# EAGLE design TeensyBalanceBoard (EAGLE 7.7.0)
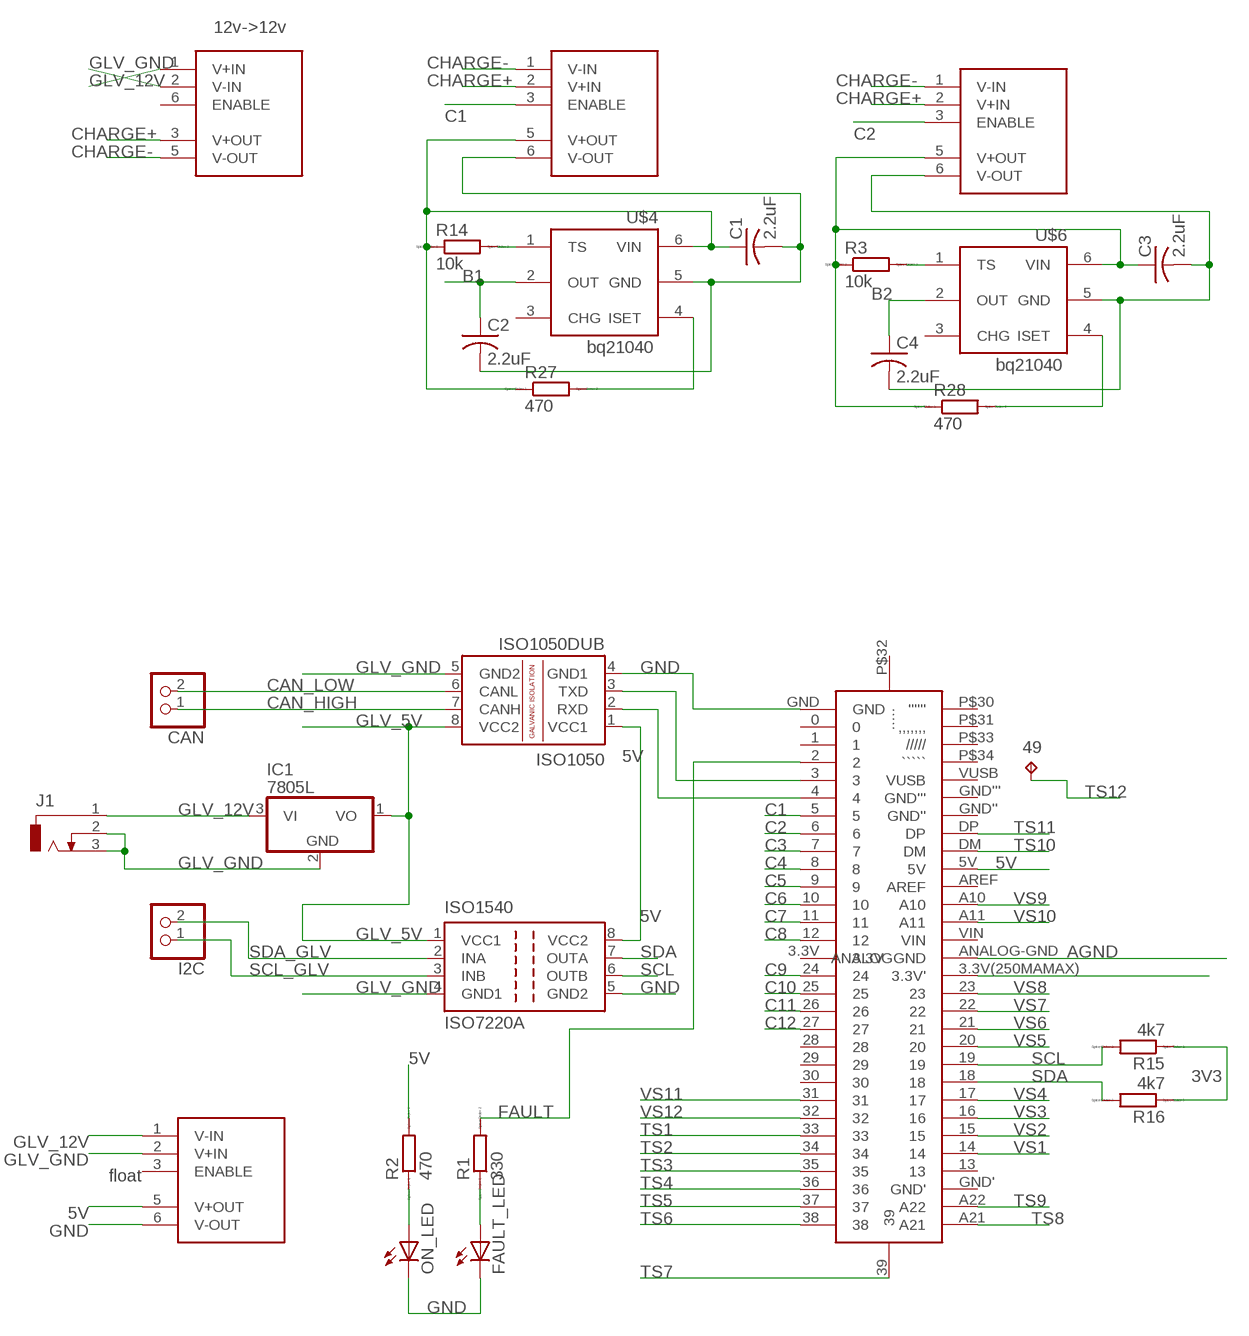
[diagram p0: schematic, sheet 1, part 1 of 2]
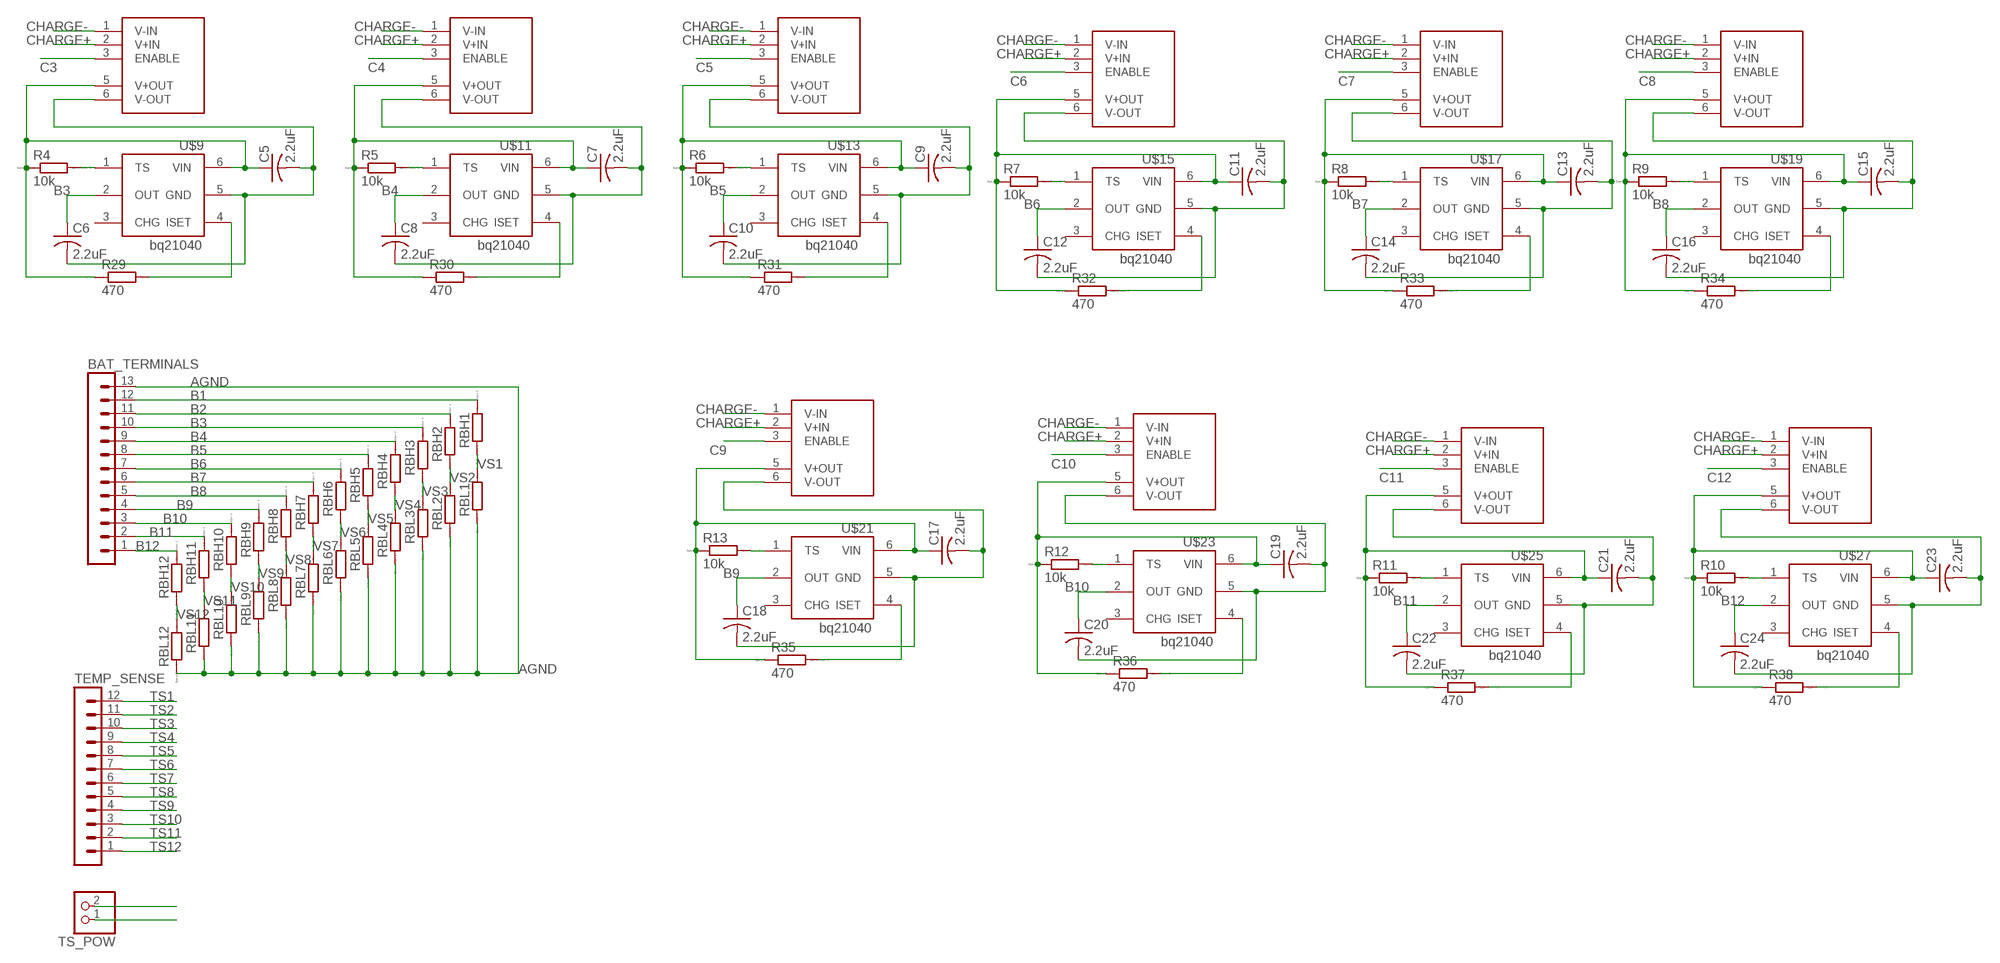
[diagram p1: schematic, sheet 1, part 2 of 2]

## Parts
49  TPTP20SQ  [TP20SQ]
BAT_TERMINALS  MA13-1  [MA13-1]
C1  2.2uF  C-USC0603  [C0603]
C2  2.2uF  C-USC0603  [C0603]
C3  2.2uF  C-USC0603  [C0603]
C4  2.2uF  C-USC0603  [C0603]
C5  2.2uF  C-USC0603  [C0603]
C6  2.2uF  C-USC0603  [C0603]
C7  2.2uF  C-USC0603  [C0603]
C8  2.2uF  C-USC0603  [C0603]
C9  2.2uF  C-USC0603  [C0603]
C10  2.2uF  C-USC0603  [C0603]
C11  2.2uF  C-USC0603  [C0603]
C12  2.2uF  C-USC0603  [C0603]
C13  2.2uF  C-USC0603  [C0603]
C14  2.2uF  C-USC0603  [C0603]
C15  2.2uF  C-USC0603  [C0603]
C16  2.2uF  C-USC0603  [C0603]
C17  2.2uF  C-USC0603  [C0603]
C18  2.2uF  C-USC0603  [C0603]
C19  2.2uF  C-USC0603  [C0603]
C20  2.2uF  C-USC0603  [C0603]
C21  2.2uF  C-USC0603  [C0603]
C22  2.2uF  C-USC0603  [C0603]
C23  2.2uF  C-USC0603  [C0603]
C24  2.2uF  C-USC0603  [C0603]
CAN  PINHD-1X2  [1X02]
FAULT_LED  LEDSMT1206  [1206]
I2C  PINHD-1X2  [1X02]
IC1  7805L  [TO92]
ISO1050  ISO1050DUB  [DUB-R-PDSO-G8]
ISO1540  ISO7220A  [SO-08]
J1  DCJ0303  [DCJ0303]
ON_LED  LEDSMT1206  [1206]
R1  330  RR0603  [R0603]
R2  470  RR0603  [R0603]
R3  10k  RR0603  [R0603]
R4  10k  RR0603  [R0603]
R5  10k  RR0603  [R0603]
R6  10k  RR0603  [R0603]
R7  10k  RR0603  [R0603]
R8  10k  RR0603  [R0603]
R9  10k  RR0603  [R0603]
R10  10k  RR0603  [R0603]
R11  10k  RR0603  [R0603]
R12  10k  RR0603  [R0603]
R13  10k  RR0603  [R0603]
R14  10k  RR0603  [R0603]
R15  4k7  RR0603  [R0603]
R16  4k7  RR0603  [R0603]
R27  470  RR0603  [R0603]
R28  470  RR0603  [R0603]
R29  470  RR0603  [R0603]
R30  470  RR0603  [R0603]
R31  470  RR0603  [R0603]
R32  470  RR0603  [R0603]
R33  470  RR0603  [R0603]
R34  470  RR0603  [R0603]
R35  470  RR0603  [R0603]
R36  470  RR0603  [R0603]
R37  470  RR0603  [R0603]
R38  470  RR0603  [R0603]
RBH1  RR0603  [R0603]
RBH2  RR0603  [R0603]
RBH3  RR0603  [R0603]
RBH4  RR0603  [R0603]
RBH5  RR0603  [R0603]
RBH6  RR0603  [R0603]
RBH7  RR0603  [R0603]
RBH8  RR0603  [R0603]
RBH9  RR0603  [R0603]
RBH10  RR0603  [R0603]
RBH11  RR0603  [R0603]
RBH12  RR0603  [R0603]
RBL1  RR0603  [R0603]
RBL2  RR0603  [R0603]
RBL3  RR0603  [R0603]
RBL4  RR0603  [R0603]
RBL5  RR0603  [R0603]
RBL6  RR0603  [R0603]
RBL7  RR0603  [R0603]
RBL8  RR0603  [R0603]
RBL9  RR0603  [R0603]
RBL10  RR0603  [R0603]
RBL11  RR0603  [R0603]
RBL12  RR0603  [R0603]
TEMP_SENSE  MA12-1  [MA12-1]
TS_POW  PINHD-1X2  [1X02]
U$1  TEENSY3.6  [TEENSY3.6]
U$2  EC4SAW-24S05N6-2411WI  [EC4SAW-24S05N]
U$3  EC4SAW-24S05N6-2411WI  [EC4SAW-24S05N]
U$4  10F200T  [SOT23-6]
U$5  EC4SAW-24S05N6-2411WI  [EC4SAW-24S05N]
U$6  10F200T  [SOT23-6]
U$7  EC4SAW-24S05N6-2411WI  [EC4SAW-24S05N]
U$8  PDQ30-Q24-S12-D  [PDQ30-Q24-S12-D]
U$9  10F200T  [SOT23-6]
U$10  EC4SAW-24S05N6-2411WI  [EC4SAW-24S05N]
U$11  10F200T  [SOT23-6]
U$12  EC4SAW-24S05N6-2411WI  [EC4SAW-24S05N]
U$13  10F200T  [SOT23-6]
U$14  EC4SAW-24S05N6-2411WI  [EC4SAW-24S05N]
U$15  10F200T  [SOT23-6]
U$16  EC4SAW-24S05N6-2411WI  [EC4SAW-24S05N]
U$17  10F200T  [SOT23-6]
U$18  EC4SAW-24S05N6-2411WI  [EC4SAW-24S05N]
U$19  10F200T  [SOT23-6]
U$20  EC4SAW-24S05N6-2411WI  [EC4SAW-24S05N]
U$21  10F200T  [SOT23-6]
U$22  EC4SAW-24S05N6-2411WI  [EC4SAW-24S05N]
U$23  10F200T  [SOT23-6]
U$24  EC4SAW-24S05N6-2411WI  [EC4SAW-24S05N]
U$25  10F200T  [SOT23-6]
U$26  EC4SAW-24S05N6-2411WI  [EC4SAW-24S05N]
U$27  10F200T  [SOT23-6]

## Nets
3V3: R15.1 R16.1 TS_POW.2 U$1.3.3V(250MAMAX)(3.3V')
5V [5vPower]: ISO1050.1(VCC1) ISO1540.8(VCC2) R2.2 U$1.5V U$3.5(V+OUT)
AGND [5vPower]: BAT_TERMINALS.13 C1.2 C2.2 RBL1.1 RBL2.1 RBL3.1 RBL4.1 RBL5.1 RBL6.1 RBL7.1 RBL8.1 RBL9.1 RBL10.1 RBL11.1 RBL12.1 TS_POW.1 U$1.ANALOG-GND(ANALOGGND) U$2.6(V-OUT) U$4.5(GND)
B1 [5vPower]: BAT_TERMINALS.12 C2.1 C3.2 C4.2 RBH1.2 U$4.2(OUT) U$5.6(V-OUT) U$6.5(GND)
B2 [5vPower]: BAT_TERMINALS.11 C4.1 C5.2 C6.2 RBH2.2 U$6.2(OUT) U$7.6(V-OUT) U$9.5(GND)
B3 [5vPower]: BAT_TERMINALS.10 C6.1 C7.2 C8.2 RBH3.2 U$9.2(OUT) U$10.6(V-OUT) U$11.5(GND)
B4 [5vPower]: BAT_TERMINALS.9 C8.1 C9.2 C10.2 RBH4.2 U$11.2(OUT) U$12.6(V-OUT) U$13.5(GND)
B5 [5vPower]: BAT_TERMINALS.8 C10.1 C11.2 C12.2 RBH5.2 U$13.2(OUT) U$14.6(V-OUT) U$15.5(GND)
B6 [5vPower]: BAT_TERMINALS.7 C12.1 C13.2 C14.2 RBH6.2 U$15.2(OUT) U$16.6(V-OUT) U$17.5(GND)
B7 [5vPower]: BAT_TERMINALS.6 C14.1 C15.2 C16.2 RBH7.2 U$17.2(OUT) U$18.6(V-OUT) U$19.5(GND)
B8 [5vPower]: BAT_TERMINALS.5 C16.1 C17.2 C18.2 RBH8.2 U$19.2(OUT) U$20.6(V-OUT) U$21.5(GND)
B9 [5vPower]: BAT_TERMINALS.4 C18.1 C19.2 C20.2 RBH9.2 U$21.2(OUT) U$22.6(V-OUT) U$23.5(GND)
B10 [5vPower]: BAT_TERMINALS.3 C20.1 C21.2 C22.2 RBH10.2 U$23.2(OUT) U$24.6(V-OUT) U$25.5(GND)
B11 [5vPower]: BAT_TERMINALS.2 C22.1 C23.2 C24.2 RBH11.2 U$25.2(OUT) U$26.6(V-OUT) U$27.5(GND)
B12 [5vPower]: BAT_TERMINALS.1 C24.1 RBH12.2 U$27.2(OUT)
C1: U$1.5 U$2.3(ENABLE)
C2: U$1.6 U$5.3(ENABLE)
C3: U$1.7 U$7.3(ENABLE)
C4: U$1.8 U$10.3(ENABLE)
C5: U$1.9 U$12.3(ENABLE)
C6: U$1.10 U$14.3(ENABLE)
C7: U$1.11 U$16.3(ENABLE)
C8: U$1.12 U$18.3(ENABLE)
C9: U$1.24 U$20.3(ENABLE)
C10: U$1.25 U$22.3(ENABLE)
C11: U$1.26 U$24.3(ENABLE)
C12: U$1.27 U$26.3(ENABLE)
CAN_HIGH: CAN.1 ISO1050.7(CANH)
CAN_LOW: CAN.2 ISO1050.6(CANL)
CHARGE+ [12vPower]: U$2.2(V+IN) U$5.2(V+IN) U$7.2(V+IN) U$8.3(V+OUT) U$10.2(V+IN) U$12.2(V+IN) U$14.2(V+IN) U$16.2(V+IN) U$18.2(V+IN) U$20.2(V+IN) U$22.2(V+IN) U$24.2(V+IN) U$26.2(V+IN)
CHARGE- [12vPower]: U$2.1(V-IN) U$5.1(V-IN) U$7.1(V-IN) U$8.5(V-OUT) U$10.1(V-IN) U$12.1(V-IN) U$14.1(V-IN) U$16.1(V-IN) U$18.1(V-IN) U$20.1(V-IN) U$22.1(V-IN) U$24.1(V-IN) U$26.1(V-IN)
FAULT: R1.2 U$1.2
GLV_5V: IC1.1(VO) ISO1050.8(VCC2) ISO1540.1(VCC1)
GLV_12V [12vPower]: IC1.3(VI) J1.1 U$3.1(V-IN) U$8.1(V+IN)
GLV_GND [12vPower]: IC1.2(GND) ISO1050.5(GND2) ISO1540.4(GND1) J1.2 J1.3 U$3.2(V+IN) U$8.2(V-IN)
GND [12vPower]: FAULT_LED.C ISO1050.4(GND1) ISO1540.5(GND2) ON_LED.C U$1.GND U$3.6(V-OUT)
N$1 [5vPower]: C1.1 R14.1 R27.1 U$2.5(V+OUT) U$4.6(VIN)
N$3: ISO1050.3(TXD) U$1.3
N$4: ISO1050.2(RXD) U$1.4
N$5 [5vPower]: C3.1 R3.1 R28.1 U$5.5(V+OUT) U$6.6(VIN)
N$6: ON_LED.A R2.1
N$7: FAULT_LED.A R1.1
N$8: R27.2 U$4.4(ISET)
N$9: R28.2 U$6.4(ISET)
N$10 [5vPower]: C5.1 R4.1 R29.1 U$7.5(V+OUT) U$9.6(VIN)
N$11: R29.2 U$9.4(ISET)
N$12 [5vPower]: C7.1 R5.1 R30.1 U$10.5(V+OUT) U$11.6(VIN)
N$13: R30.2 U$11.4(ISET)
N$14 [5vPower]: C9.1 R6.1 R31.1 U$12.5(V+OUT) U$13.6(VIN)
N$15: R31.2 U$13.4(ISET)
N$16 [5vPower]: C11.1 R7.1 R32.1 U$14.5(V+OUT) U$15.6(VIN)
N$17: R32.2 U$15.4(ISET)
N$18 [5vPower]: C13.1 R8.1 R33.1 U$16.5(V+OUT) U$17.6(VIN)
N$19: R33.2 U$17.4(ISET)
N$20 [5vPower]: C15.1 R9.1 R34.1 U$18.5(V+OUT) U$19.6(VIN)
N$21: R34.2 U$19.4(ISET)
N$22 [5vPower]: C17.1 R13.1 R35.1 U$20.5(V+OUT) U$21.6(VIN)
N$23: R35.2 U$21.4(ISET)
N$24 [5vPower]: C19.1 R12.1 R36.1 U$22.5(V+OUT) U$23.6(VIN)
N$25: R36.2 U$23.4(ISET)
N$26 [5vPower]: C21.1 R11.1 R37.1 U$24.5(V+OUT) U$25.6(VIN)
N$27: R37.2 U$25.4(ISET)
N$28 [5vPower]: C23.1 R10.1 R38.1 U$26.5(V+OUT) U$27.6(VIN)
N$29: R38.2 U$27.4(ISET)
N$30: R3.2 U$6.1(TS)
N$31: R13.2 U$21.1(TS)
N$32: R12.2 U$23.1(TS)
N$33: R11.2 U$25.1(TS)
N$34: R10.2 U$27.1(TS)
N$35: R9.2 U$19.1(TS)
N$36: R8.2 U$17.1(TS)
N$37: R7.2 U$15.1(TS)
N$38: R6.2 U$13.1(TS)
N$39: R5.2 U$11.1(TS)
N$40: R4.2 U$9.1(TS)
N$41: R14.2 U$4.1(TS)
SCL: ISO1540.6(OUTB) R15.2 U$1.19
SCL_GLV: I2C.1 ISO1540.3(INB)
SDA: ISO1540.7(OUTA) R16.2 U$1.18
SDA_GLV: I2C.2 ISO1540.2(INA)
TS1: TEMP_SENSE.12 U$1.33
TS2: TEMP_SENSE.11 U$1.34
TS3: TEMP_SENSE.10 U$1.35
TS4: TEMP_SENSE.9 U$1.36
TS5: TEMP_SENSE.8 U$1.37
TS6: TEMP_SENSE.7 U$1.38
TS7: TEMP_SENSE.6 U$1.39
TS8: TEMP_SENSE.5 U$1.A21
TS9: TEMP_SENSE.4 U$1.A22
TS10: TEMP_SENSE.3 U$1.DM
TS11: TEMP_SENSE.2 U$1.DP
TS12: 49.TP TEMP_SENSE.1
VS1: RBH1.1 RBL1.2 U$1.14
VS2: RBH2.1 RBL2.2 U$1.15
VS3: RBH3.1 RBL3.2 U$1.16
VS4: RBH4.1 RBL4.2 U$1.17
VS5: RBH5.1 RBL5.2 U$1.20
VS6: RBH6.1 RBL6.2 U$1.21
VS7: RBH7.1 RBL7.2 U$1.22
VS8: RBH8.1 RBL8.2 U$1.23
VS9: RBH9.1 RBL9.2 U$1.A10
VS10: RBH10.1 RBL10.2 U$1.A11
VS11: RBH11.1 RBL11.2 U$1.31
VS12: RBH12.1 RBL12.2 U$1.32
Unconnected: U$1.0 U$1.1 U$1.3.3V U$1.13 U$1.28 U$1.29 U$1.30 U$1.AREF U$1.GND' U$1.GND'' U$1.GND''' U$1.P$30('''''') U$1.P$31(,,,,,,,) U$1.P$32(.....) U$1.P$33(/////) U$1.P$34(`````) U$1.VIN U$1.VUSB U$3.3(ENABLE) U$4.3(CHG) U$6.3(CHG) U$8.6(ENABLE) U$9.3(CHG) U$11.3(CHG) U$13.3(CHG) U$15.3(CHG) U$17.3(CHG) U$19.3(CHG) U$21.3(CHG) U$23.3(CHG) U$25.3(CHG) U$27.3(CHG)

## Notes on the sheet
- 12v->12v
- float

## Library data of the parts
49 = testpad:TP: Test pad
BAT_TERMINALS = con-lstb:MA13-1: PIN HEADER; OC_FARNELL: unknown; OC_NEWARK: unknown
C1-C24 = adafruit:C-US: CAPACITOR, American symbol
CAN I2C TS_POW = pinhead:PINHD-1X2: PIN HEADER
FAULT_LED ON_LED = led:LED: LED OSRAM: - CHIPLED LG R971, LG N971, LY N971, LG Q971, LY Q971, LO R971, LY R971 LH N974, LH R974 LS Q976, LO Q976, LY Q976 LO Q996 - Hyper CHIPLED LW Q18S LB Q993, LB Q99A, LB R99A - SideLED LS A670, LO A670, LY A670, LG A670, LP A670 LB A673, LV A673, LT A673, LW A673 LH A674 LY A675 LS A676, LA A676, LO A676, LY A676, LW A676 LS A679, LY A679, LG A679 - Hyper Micro SIDELED® LS Y876, LA Y876, LO Y876, LY Y876 LT Y87S - SmartLED LW L88C, LW L88S LB L89C, LB L89S, LG L890 LS L89K, LO L89K, LY L89K LS L896, LA L896, LO L896, LY L896 - TOPLED LS T670, LO T670, LY T670, LG T670, LP T670 LSG T670, LSP T670, LSY T670, LOP T670, LYG T670 LG T671, LOG T671, LSG T671 LB T673, LV T673, LT T673, LW T673 LH T674 LS T676, LA T676, LO T676, LY T676, LB T676, LH T676, LSB T676, LW T676 LB T67C, LV T67C, LT T67C, LS T67K, LO T67K, LY T67K, LW E67C LS E67B, LA E67B, LO E67B, LY E67B, LB E67C, LV E67C, LT E67C LW T67C LS T679, LY T679, LG T679 LS T770, LO T770, LY T770, LG T770, LP T770 LB T773, LV T773, LT T773, LW T773 LH T774 LS E675, LA E675, LY E675, LS T675 LS T776, LA T776, LO T776, LY T776, LB T776 LHGB T686 LT T68C, LB T68C - Hyper Mini TOPLED® LB M676 - Mini TOPLED Santana® LG M470 LS M47K, LO M47K, LY M47K Source: http://www.osram.convergy.de LUXEON: - LUMILED® LXK2-PW12-R00, LXK2-PW12-S00, LXK2-PW14-U00, LXK2-PW14-V00 LXK2-PM12-R00, LXK2-PM12-S00, LXK2-PM14-U00 LXK2-PE12-Q00, LXK2-PE12-R00, LXK2-PE12-S00, LXK2-PE14-T00, LXK2-PE14-U00 LXK2-PB12-K00, LXK2-PB12-L00, LXK2-PB12-M00, LXK2-PB14-N00, LXK2-PB14-P00, LXK2-PB14-Q00 LXK2-PR12-L00, LXK2-PR12-M00, LXK2-PR14-Q00, LXK2-PR14-R00 LXK2-PD12-Q00, LXK2-PD12-R00, LXK2-PD12-S00 LXK2-PH12-R00, LXK2-PH12-S00 LXK2-PL12-P00, LXK2-PL12-Q00, LXK2-PL12-R00 Source: www.luxeon.com KINGBRIGHT: KA-3528ASYC Source: www.kingbright.com
IC1 = linear:78*: Positive VOLTAGE REGULATOR Source: http://cache.national.com/ds/LM/LM78L05.pdf http://www.fairchildsemi.com/ds/LM/LM7805.pdf
ISO1050 = texas:ISO1050: ISOLATED CAN TRANSCEIVER Source: http://focus.ti.com/lit/ds/symlink/iso1050.pdf; MPN: ISO1050DUBR; OC_FARNELL: 1755712; OC_NEWARK: 14R9899
ISO1540 = texas:ISO7220: DUAL DIGITAL ISOLATORS Source: http://focus.ti.com/lit/ds/symlink/iso7221a.pdf; MPN: ISO7220AD; OC_FARNELL: 1390649; OC_NEWARK: 48M0666
J1 = con-jack:DCJ0303: DC POWER JACK Source: DCJ0303.pdf; OC_FARNELL: unknown; OC_NEWARK: unknown
R1-R16 R27-R38 RBH1-RBH12 RBL1-RBL12 = eagle-ltspice:R: RESISTOR, European symbol; SPICEMODEL: NONE; SPICEPREFIX: R
TEMP_SENSE = con-lstb:MA12-1: PIN HEADER; OC_FARNELL: unknown; OC_NEWARK: unknown
U$1 = Teensy36:TEENSY3.6
U$2 U$3 U$5 U$7 U$10 U$12 U$14 U$16 U$18 U$20 U$22 U$24 U$26 = Teensy36:EC4SAW-24S05N
U$4 U$6 U$9 U$11 U$13 U$15 U$17 U$19 U$21 U$23 U$25 U$27 = adafruit:10F200T: PIC10F200/202/204/206 Ultra-small 8-bit PIC micros in SOT-23-6 and SOIC
U$8 = Teensy36:PDQ30-Q24-S12-D

## Net classes
0 default: width 0.203 mm
1 12vPower: width 1.016 mm
2 5vPower: width 0.508 mm

## Board
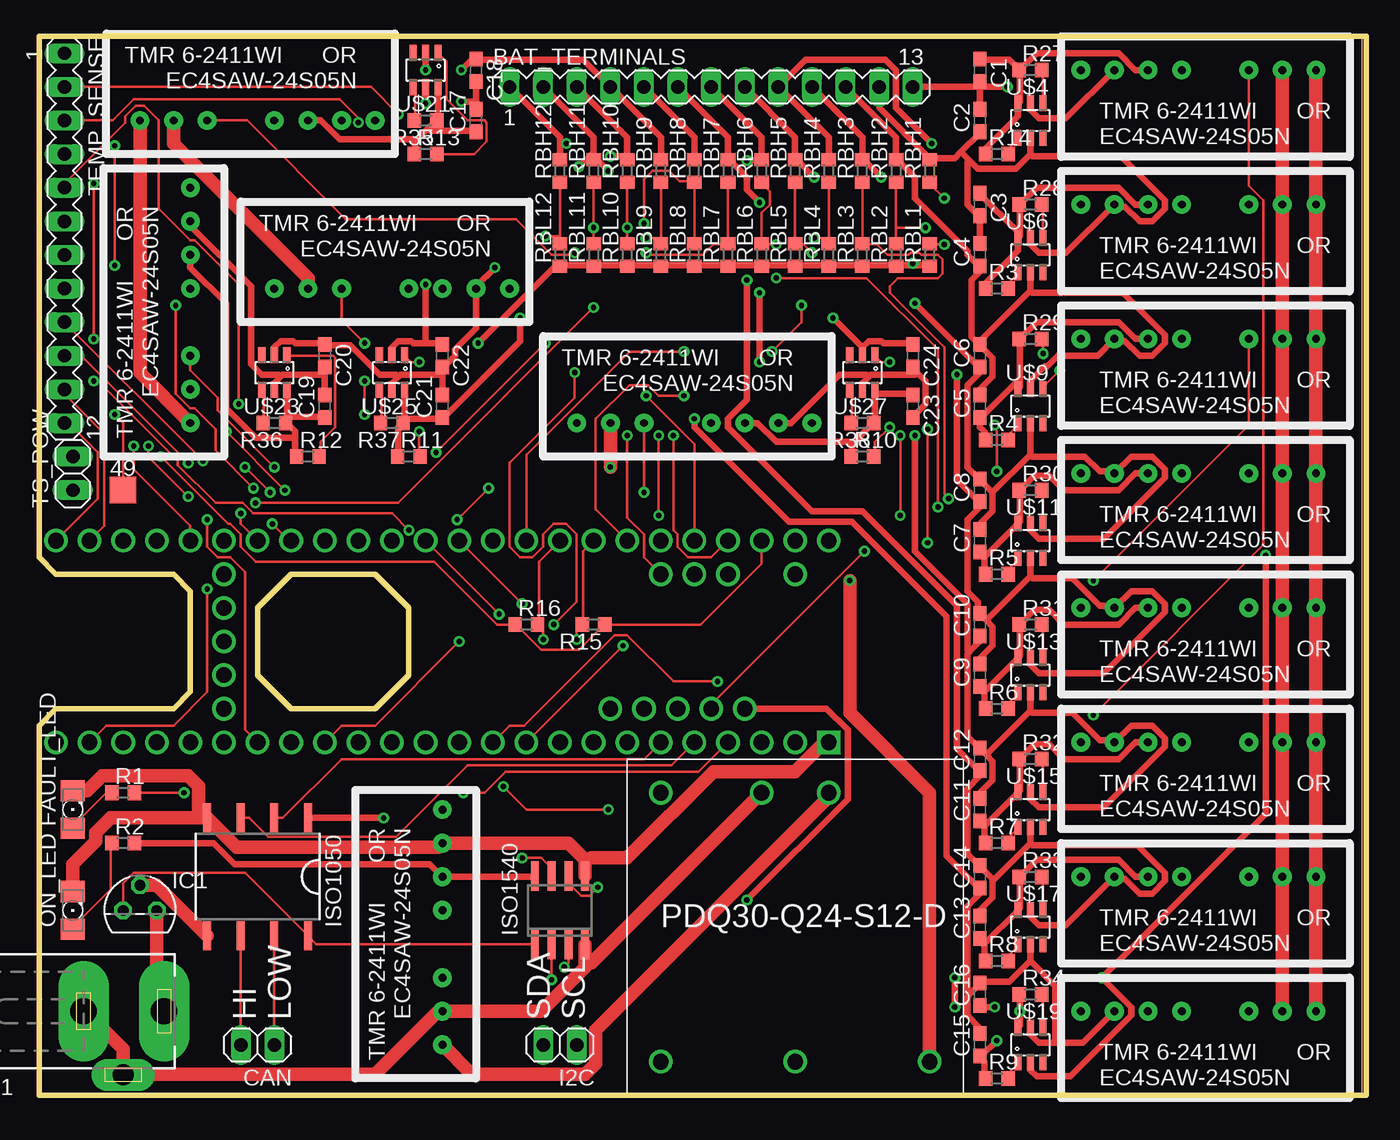
[diagram p2: board, top side]
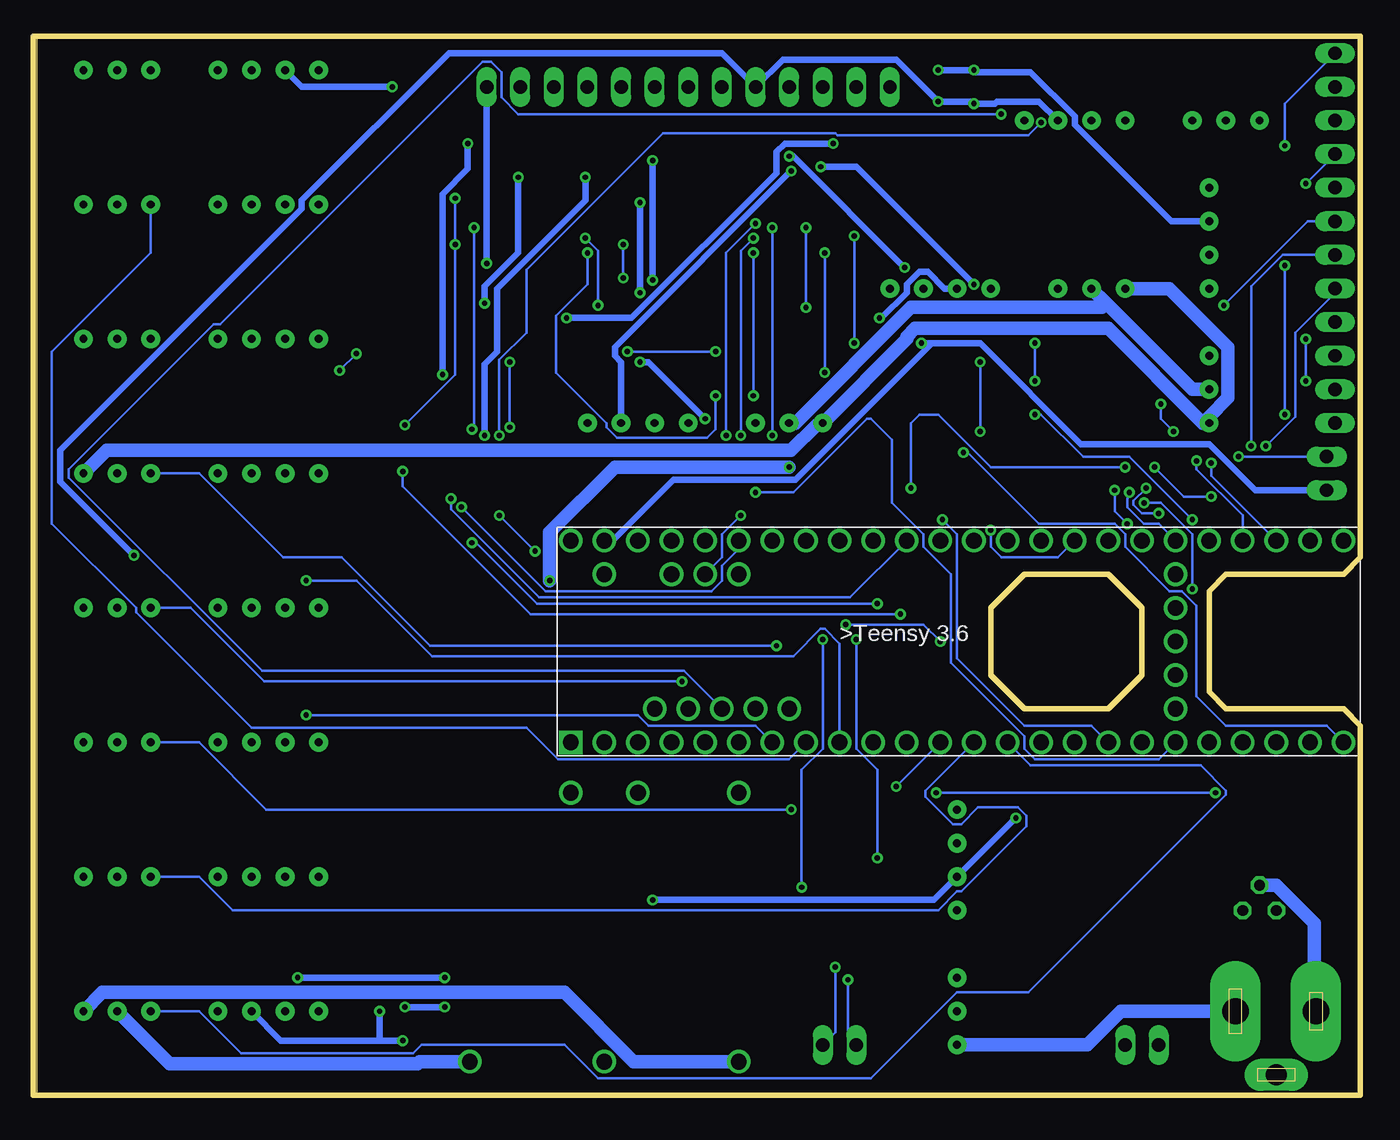
[diagram p3: board, bottom side, seen from below]

Size 100.33 x 80.01 mm. Coordinates in mm from the lower left corner, seen from the top.
Outline: 0,0 100,0 100,80 0,80 0,43.18
Outline: 0,0 0,27.94 1.27,29.21 10.16,29.21 11.43,30.48 11.43,38.1 10.16,39.37 1.27,39.37 0,40.64 0,43.18
Outline: 0,0 100.33,0 100.33,80.01 0,80.01 0,43.18
Outline: 16.51,31.75 19.05,29.21 25.4,29.21 27.94,31.75 27.94,36.83 25.4,39.37 19.05,39.37 16.51,36.83 16.51,31.75
Copper layers (1*16): Top 0.035mm / dielectric 1.5mm / Bottom 0.035mm
Design rules "default *": minimum track width 6mil, minimum drill 16mil, track to track 6mil, track to pad 6mil, pad to pad 6mil, via to via 6mil, smd to smd 6mil, copper to edge 20mil, drill to drill 6mil, minimum pad ring 10mil, minimum via ring 8mil, stop-mask expansion 4mil, vias tented up to drill 0mil, thermal gap 10mil

### Footprints (pad centres in the part's own frame; a part is rotated, then mirrored left to right if it is on the bottom)
TP20SQ = smd 2 x 2: TP 0,0
MA13-1 = drill 1.016 long: 1 -15.24,0; 2 -12.7,0; 3 -10.16,0; 4 -7.62,0; 5 -5.08,0; 6 -2.54,0; 7 0,0; 8 2.54,0; 9 5.08,0; 10 7.62,0; 11 10.16,0; 12 12.7,0; 13 15.24,0
C0603 = smd 1.1 x 1: 1 -0.85,0; 2 0.85,0
1X02 = drill 1.016 long: 1 -1.27,0; 2 1.27,0
1206 = smd 1.6 x 1.803: A -1.422,0; C 1.422,0
TO92 = drill 0.813 octagon: 1 -1.27,0; 2 0,1.905; 3 1.27,0
DUB-R-PDSO-G8 = smd 0.6 x 2.2: 1 -3.81,-4.445; 2 -1.27,-4.445; 3 1.27,-4.445; 4 3.81,-4.445; 5 3.81,4.445; 6 1.27,4.445; 7 -1.27,4.445; 8 -3.81,4.445
SO-08 = smd 0.6 x 2.2: 1 -1.905,-2.6; 2 -0.635,-2.6; 3 0.635,-2.6; 4 1.905,-2.6; 5 1.905,2.6; 6 0.635,2.6; 7 -0.635,2.6; 8 -1.905,2.6
DCJ0303 = drill 2 pad 3.81 long: 1 0,3.1; 3 0,-3 | drill 1.6 pad 2 long: 2 4.8,0
R0603 = smd 1 x 1.1: 1 -0.85,0; 2 0.85,0
MA12-1 = drill 1.016 long: 1 -13.97,0; 2 -11.43,0; 3 -8.89,0; 4 -6.35,0; 5 -3.81,0; 6 -1.27,0; 7 1.27,0; 8 3.81,0; 9 6.35,0; 10 8.89,0; 11 11.43,0; 12 13.97,0
TEENSY3.6 = drill 1.19: 0 2.54,-15.24; 1 5.08,-15.24; 2 7.62,-15.24; 3 10.16,-15.24; 3.3V 35.56,-15.24; 3.3V(250MAMAX) 5.08,0; 4 12.7,-15.24; 5 15.24,-15.24; 5V 6.35,-12.7; 6 17.78,-15.24; 7 20.32,-15.24; 8 22.86,-15.24; 9 25.4,-15.24; 10 27.94,-15.24; 11 30.48,-15.24; 12 33.02,-15.24; 13 33.02,0; 14 30.48,0; 15 27.94,0; 16 25.4,0; 17 22.86,0; 18 20.32,0; 19 17.78,0; 20 15.24,0; 21 12.7,0; 22 10.16,0; 23 7.62,0; 24 38.1,-15.24; 25 40.64,-15.24; 26 43.18,-15.24; 27 45.72,-15.24; 28 48.26,-15.24; 29 50.8,-15.24; 30 53.34,-15.24; 31 55.88,-15.24; 32 58.42,-15.24; 33 58.42,0; 34 55.88,0; 35 53.34,0; 36 50.8,0; 37 48.26,0; 38 45.72,0; 39 43.18,0; A10 10.16,-2.54; A11 12.7,-2.54; A21 40.64,0; A22 38.1,0; ANALOG-GND 2.54,0; AREF 7.62,-2.54; DM 8.89,-12.7; DP 11.43,-12.7; GND' 35.56,0; GND'' 13.97,-12.7; GND''' 16.51,-12.7; P$30 45.72,-12.7; P$31 45.72,-10.16; P$32 45.72,-7.62; P$33 45.72,-5.08; P$34 45.72,-2.54; VIN 0,0; VUSB 2.54,-2.54 | drill 1.19 square: GND 0,-15.24
EC4SAW-24S05N = drill 0.6 pad 1.422: 1 2.54,2.54; 2 5.08,2.54; 3 7.62,2.54; 4 12.7,2.54; 5 15.24,2.54; 6 17.78,2.54; 7 20.32,2.54
SOT23-6 = smd 0.55 x 1.2: 1 -0.95,-1.3; 2 0,-1.3; 3 0.95,-1.3; 4 0.95,1.3; 5 0,1.3; 6 -0.95,1.3
PDQ30-Q24-S12-D = drill 1.19: 1 15.24,22.86; 2 10.16,22.86; 3 22.86,2.54; 4 12.7,2.54; 5 2.54,2.54; 6 2.54,22.86

### Placement (x,y rotation side)
49  6.35,45.72 0 top
BAT_TERMINALS  50.8,76.2 0 top
C1  71.12,77.47 270 top
C2  71.12,73.66 90 top
C3  71.12,67.31 270 top
C4  71.12,63.5 90 top
C5  71.12,52.07 90 top
C6  71.12,55.88 90 top
C7  71.12,41.91 90 top
C8  71.12,45.72 90 top
C9  71.12,31.75 90 top
C10  71.12,35.56 90 top
C11  71.12,21.59 90 top
C12  71.12,25.4 90 top
C13  71.12,12.7 90 top
C14  71.12,16.51 90 top
C15  71.12,3.81 90 top
C16  71.12,7.62 90 top
C17  33.02,73.66 90 top
C18  33.02,77.47 270 top
C19  21.59,52.07 90 top
C20  21.59,55.88 270 top
C21  30.48,52.07 90 top
C22  30.48,55.88 270 top
C23  66.04,52.07 270 top
C24  66.04,55.88 270 top
CAN  16.51,3.81 180 top
FAULT_LED  2.54,21.59 90 top
I2C  39.37,3.81 180 top
IC1  7.62,13.97 0 top
ISO1050  16.51,16.51 180 top
ISO1540  39.37,13.97 0 top
J1  6.35,6.35 270 top
ON_LED  2.54,13.97 90 top
R1  6.35,22.86 0 top
R2  6.35,19.05 0 top
R3  72.39,60.96 0 top
R4  72.39,49.53 0 top
R5  72.39,39.37 0 top
R6  72.39,29.21 0 top
R7  72.39,19.05 0 top
R8  72.39,10.16 0 top
R9  72.39,1.27 0 top
R10  62.23,48.26 0 top
R11  27.94,48.26 0 top
R12  20.32,48.26 0 top
R13  29.21,71.12 0 top
R14  72.39,71.12 0 top
R15  41.91,35.56 180 top
R16  36.83,35.56 0 top
R27  74.93,77.47 0 top
R28  74.93,67.31 0 top
R29  74.93,57.15 0 top
R30  74.93,45.72 0 top
R31  74.93,35.56 0 top
R32  74.93,25.4 0 top
R33  74.93,16.51 0 top
R34  74.93,7.62 0 top
R35  29.21,73.66 180 top
R36  17.78,50.8 180 top
R37  26.67,50.8 180 top
R38  62.23,50.8 180 top
RBH1  67.31,69.85 90 top
RBH2  64.77,69.85 90 top
RBH3  62.23,69.85 90 top
RBH4  59.69,69.85 90 top
RBH5  57.15,69.85 90 top
RBH6  54.61,69.85 90 top
RBH7  52.07,69.85 90 top
RBH8  49.53,69.85 90 top
RBH9  46.99,69.85 90 top
RBH10  44.45,69.85 90 top
RBH11  41.91,69.85 90 top
RBH12  39.37,69.85 90 top
RBL1  67.31,63.5 90 top
RBL2  64.77,63.5 90 top
RBL3  62.23,63.5 90 top
RBL4  59.69,63.5 90 top
RBL5  57.15,63.5 90 top
RBL6  54.61,63.5 90 top
RBL7  52.07,63.5 90 top
RBL8  49.53,63.5 90 top
RBL9  46.99,63.5 90 top
RBL10  44.45,63.5 90 top
RBL11  41.91,63.5 90 top
RBL12  39.37,63.5 90 top
TEMP_SENSE  1.91,64.77 270 top
TS_POW  2.54,46.99 90 top
U$1  59.69,41.91 0 bottom
U$2  99.06,80.01 180 top
U$3  33.02,1.27 90 top
U$4  74.93,73.66 0 top
U$5  99.06,69.85 180 top
U$6  74.93,63.5 0 top
U$7  99.06,59.69 180 top
U$8  44.45,0 0 top
U$9  74.93,52.07 0 top
U$10  99.06,49.53 180 top
U$11  74.93,41.91 0 top
U$12  99.06,39.37 180 top
U$13  74.93,31.75 0 top
U$14  99.06,29.21 180 top
U$15  74.93,21.59 0 top
U$16  99.06,19.05 180 top
U$17  74.93,12.7 0 top
U$18  99.06,8.89 180 top
U$19  74.93,3.81 0 top
U$20  5.08,71.12 0 top
U$21  29.21,77.47 180 top
U$22  13.97,48.26 90 top
U$23  17.78,54.61 180 top
U$24  15.24,58.42 0 top
U$25  26.67,54.61 180 top
U$26  38.1,48.26 0 top
U$27  62.23,54.61 180 top

### Tracks (layer width: path | path; a pad name or v marks a point on that pad's centre or on a via)
3V3  (via drill 0.41)
  Top 0.203: v9.21,48.26 14.29,43.18 14.45,43.18 15.24,42.39 15.24,41.43 16.35,40.32 29.84,40.32 34.61,35.56 R16.1 36.04,35.56 37.94,33.66 40.8,33.66 42.7,35.56 R15.1 50.01,35.56 54.61,40.16 U$1.3.3V(250MAMAX)
  Bottom 0.203: v9.21,48.26 TS_POW.2
5V  (via drill 0.41)
  Top 0.508: R2.2 13.18,19.05 14.76,17.46 29.53,17.46 U$3.5 37.47,16.51 ISO1540.8 | v26.04,20.95 ISO1050.1 | U$1.5V 59.53,29.21 61.12,27.62 61.12,22.38 v53.5,14.76
  Bottom 0.508: v26.04,20.95 U$3.5 32.23,14.76 v53.5,14.76
AGND  (via drill 0.41)
  Top 0.508: C1.2 C2.2 | BAT_TERMINALS.13 70.96,76.2 C1.2 | U$4.5 74.93,74.45 75.56,73.82 77.63,73.82 U$2.6 | v73.18,76.2 71.28,76.2 C1.2 | 66.04,62.71 64.93,62.71 RBL2.1 64.77,62.71 62.39,62.71 RBL3.1 62.23,62.71 59.85,62.71 RBL4.1 59.69,62.71 57.31,62.71 RBL5.1 57.15,62.71 54.77,62.71 RBL6.1 54.61,62.71 52.23,62.71 RBL7.1 52.07,62.71 49.69,62.71 RBL8.1 49.53,62.71 47.15,62.71 RBL9.1 46.99,62.71 44.61,62.71 RBL10.1 44.45,62.71 42.07,62.71 RBL11.1 41.91,62.71 39.37,62.71 RBL12.1 39.21,62.87 v33.18,56.83 | 66.04,62.71 67.31,62.71 RBL1.1 | v66.04,62.87 66.04,62.71
  Bottom 0.508: v73.18,76.2 80.01,76.2 U$2.6 | TS_POW.1 7.94,45.72 11.43,49.21 21.11,49.21 28.73,56.83 32.54,56.83 | v33.18,56.83 32.54,56.83 | U$1.ANALOG-GND 56.52,41.91 51.91,46.51 42.7,46.51 32.54,56.67 32.54,56.83 | v66.04,62.87 BAT_TERMINALS.13
B1
  Top 0.508: U$6.5 74.93,64.29 75.56,63.66 77.63,63.66 U$5.6 81.44,67.15 82.07,67.15 83.19,66.04 84.14,66.04 85.09,66.99 85.09,67.63 81.76,70.96 75.09,70.96 74.93,71.12 | C4.2 C3.2 70.96,66.52 70.17,67.31 70.17,70.48 70.33,70.64 | 69.69,71.28 71.12,72.71 C2.1 | 69.69,71.28 69.22,70.8 67.31,70.8 RBH1.2 67.15,70.96 63.5,74.61 BAT_TERMINALS.12 | 74.93,71.12 U$4.2 | 74.93,71.12 73.82,70.01 70.96,70.01 70.33,70.64 | 69.69,71.28 70.33,70.64
B2
  Top 0.508: U$9.5 74.93,53.98 76.04,55.09 76.2,55.09 76.99,55.88 80.01,55.88 U$7.6 81.44,56.99 82.07,56.99 83.19,55.88 84.14,55.88 85.09,56.83 85.09,57.47 81.92,60.64 75.09,60.64 74.93,60.8 | BAT_TERMINALS.11 64.77,72.39 RBH2.2 64.93,70.64 66.2,69.37 66.2,67.79 70.17,63.82 70.17,63.5 70.96,62.71 C4.1 71.12,62.23 70.48,61.59 70.48,57.31 70.96,56.83 C6.2 | C5.2 71.12,53.34 72.07,54.29 72.07,55.72 71.12,56.67 C6.2 | 74.93,60.8 U$6.2 | 74.93,60.8 71.12,56.99 C6.2
B3  (via drill 0.41)
  Top 0.508: U$11.5 74.93,42.7 75.56,42.07 80.49,42.07 85.09,46.67 85.09,47.31 84.14,48.26 82.55,48.26 U$10.6 81.12,47.15 80.17,47.15 79.06,48.26 75.09,48.26 74.93,48.42 | BAT_TERMINALS.10 62.23,72.39 RBH3.2 62.39,70.64 v63.66,69.37 | C7.2 71.12,43.18 72.07,44.13 72.07,45.56 | 72.07,45.56 71.12,46.51 C8.2 70.96,46.67 70.17,47.47 70.17,53.66 71.12,54.61 C6.1 70.96,55.09 v66.2,59.85 | 74.93,48.42 U$9.2 | 72.07,45.56 74.93,48.42
  Bottom 0.508: v63.66,69.37 63.66,63.66 66.2,61.12 v66.2,59.85
B4  (via drill 0.41)
  Top 0.508: U$13.5 74.93,32.54 75.56,31.91 80.49,31.91 85.09,36.51 85.09,37.15 84.14,38.1 82.55,38.1 U$12.6 81.12,36.99 80.17,36.99 78.11,39.05 75.09,39.05 74.93,39.21 | RBH4.2 59.69,72.39 BAT_TERMINALS.9 57.94,78.26 63.98,78.26 64.77,77.47 64.77,74.61 v67.47,71.91 | C9.2 71.12,33.02 72.07,33.97 72.07,35.4 71.6,35.88 | 71.6,35.88 71.12,36.35 C10.2 70.96,36.51 70.96,37.31 70.17,38.1 70.17,43.5 71.12,44.45 C8.1 70.96,44.93 69.37,46.51 v69.37,54.45 | 74.93,39.21 U$11.2 | 71.6,35.88 74.93,39.21
  Bottom 0.508: v67.47,71.91 67.47,70.01 69.37,68.1 v69.37,54.45
B5  (via drill 0.41)
  Top 0.508: U$15.5 74.93,22.38 75.56,21.75 80.49,21.75 85.09,26.35 85.09,26.99 84.14,27.94 82.55,27.94 U$14.6 81.12,26.83 80.17,26.83 78.11,28.89 75.09,28.89 74.93,29.05 | BAT_TERMINALS.8 57.15,72.39 RBH5.2 57.31,70.64 v58.58,69.37 | C11.2 71.12,22.86 72.07,23.81 72.07,25.24 71.6,25.72 | 71.6,25.72 71.12,26.19 C12.2 70.96,26.35 70.17,27.15 70.17,33.34 70.33,33.5 | C10.1 71.12,34.29 70.33,33.5 | 74.93,29.05 U$13.2 | 71.6,25.72 74.93,29.05 | v66.2,49.85 66.2,41.12 70.17,37.15 70.17,33.66 70.33,33.5
  Bottom 0.508: v58.58,69.37 58.58,67.63 65.25,60.96 65.25,56.2 66.2,55.24 v66.2,49.85
B6  (via drill 0.41)
  Top 0.508: BAT_TERMINALS.7 54.61,72.39 RBH6.2 54.45,70.64 v53.5,70.64 | U$17.5 74.93,13.49 75.56,12.86 77.63,12.86 U$16.6 81.44,16.35 82.07,16.35 83.19,15.24 84.14,15.24 85.09,16.19 85.09,16.83 83.03,18.89 75.09,18.89 74.93,19.05 | C13.2 71.12,13.97 72.07,14.92 72.07,16.35 | 72.07,16.35 71.12,17.3 C14.2 70.96,17.46 70.17,18.26 70.17,23.18 71.12,24.13 C12.1 70.96,24.61 69.37,26.19 69.37,36.99 62.23,44.13 58.42,44.13 52.07,50.48 52.07,51.12 53.5,52.55 v53.5,61.59 | 74.93,19.05 U$15.2 | 74.93,19.05 72.23,16.35 72.07,16.35
  Bottom 0.508: v53.5,61.59 v53.5,70.64
B7  (via drill 0.41)
  Top 0.508: BAT_TERMINALS.6 52.07,72.39 RBH7.2 52.23,70.64 53.5,69.37 53.5,68.42 v54.45,67.47 | U$19.5 74.93,4.6 75.56,3.97 76.83,3.97 | 76.83,3.97 78.9,3.97 U$18.6 | C15.2 71.12,5.08 70.17,6.03 70.17,7.46 70.33,7.62 | 70.33,7.62 71.12,8.41 C16.2 71.28,8.57 73.34,8.57 74.93,10.16 | 70.33,7.62 70.17,7.78 70.17,14.29 71.12,15.24 C14.1 70.96,15.72 68.58,18.1 68.58,36.2 61.44,43.34 56.67,43.34 49.53,50.48 v49.53,51.12 | 74.93,10.16 U$17.2 | 76.83,3.97 76.83,8.26 74.93,10.16 | v54.45,55.4 v54.45,60.64
  Bottom 0.508: v54.45,60.64 v54.45,67.47 | v54.45,55.4 53.82,55.4 v49.53,51.12
B8  (via drill 0.41)
  Top 0.508: v72.23,6.67 71.12,6.67 C16.1 | v69.22,8.89 v69.22,6.67 | U$19.2 74.93,1.91 75.41,1.43 77.95,1.43 82.55,6.03 82.55,6.67 v80.33,8.89 92.71,21.27 v92.71,40.8 | RBH8.2 49.53,72.39 BAT_TERMINALS.5 | C18.2 33.02,75.09 | 33.02,75.09 C17.2 | v29.21,74.93 U$21.5 | v31.91,75.09 33.02,75.09
  Bottom 0.508: v69.22,6.67 v72.23,6.67 | v80.33,8.89 v69.22,8.89 | U$20.6 24.29,75.09 27.46,75.09 27.62,74.93 v29.21,74.93 29.37,75.09 v31.91,75.09 35.08,78.26 43.66,78.26 BAT_TERMINALS.5 48.26,78.74 68.9,78.74 80.01,67.63 80.01,66.99 98.27,48.74 98.27,46.35 v92.71,40.8
B9  (via drill 0.41)
  Top 0.508: C20.2 21.59,54.45 | 21.59,54.45 C19.2 | U$23.5 17.78,53.82 18.26,54.29 | 18.26,54.29 18.41,54.45 21.59,54.45 | U$22.6 11.43,65.72 16.03,61.12 16.03,55.24 16.83,54.45 18.1,54.45 18.26,54.29 | RBH9.2 46.99,72.39 BAT_TERMINALS.4 41.12,78.26 33.02,78.26 C18.1 32.86,78.42 v31.91,77.47 | v29.21,77.47 U$21.2
  Bottom 0.508: v31.91,77.47 v29.21,77.47 29.05,77.31 24.92,77.31 21.59,73.98 21.59,73.34 14.29,66.04 U$22.6
B10  (via drill 0.41)
  Top 0.508: BAT_TERMINALS.3 44.45,72.39 RBH10.2 44.29,70.96 v43.18,70.96 | U$23.2 17.78,56.52 18.26,56.99 19.21,56.99 19.37,56.83 21.59,56.83 C20.1 21.75,56.67 23.5,56.67 25.72,54.45 26.99,54.45 27.15,54.29 | 30.48,54.45 C22.2 30.64,55.09 31.43,55.88 31.43,56.36 33.02,57.94 U$24.6 33.02,61.12 v34.45,62.55 | 30.48,54.45 C21.2 | U$25.5 26.67,53.82 27.15,54.29 | 27.15,54.29 27.3,54.45 30.48,54.45
  Bottom 0.508: v43.18,70.96 42.86,70.96 v34.45,62.55
B11  (via drill 0.41)
  Top 0.508: 66.36,54.61 66.04,54.93 C24.2 | 66.36,54.61 66.99,53.98 66.99,52.23 66.04,51.28 C23.2 | U$27.5 62.23,53.82 62.71,54.29 | 62.71,54.29 62.87,54.45 66.2,54.45 66.36,54.61 | U$26.6 56.83,50.8 60.48,54.45 62.55,54.45 62.71,54.29 | 29.21,56.83 28.26,56.83 28.1,56.99 27.15,56.99 26.67,56.52 U$25.2 | 29.21,56.83 30.48,56.83 C22.1 | RBH11.2 41.91,72.39 BAT_TERMINALS.2 | v29.21,61.28 29.21,56.83 | v40.8,70.17 41.75,71.12 RBH11.2 | v43.02,69.85 42.07,70.8 RBH11.2
  Bottom 0.508: v29.21,61.28 38.1,70.17 v40.8,70.17 | U$26.6 55.88,55.4 56.36,55.88 56.36,56.52 v43.02,69.85
B12  (via drill 0.41)
  Top 0.508: 62.23,56.52 62.71,56.99 63.66,56.99 63.82,56.83 66.04,56.83 C24.1 | U$27.2 62.23,56.52 | 39.37,71.91 39.37,72.39 BAT_TERMINALS.1 | 39.37,71.91 RBH12.2 | v60.01,58.74 62.23,56.52 | 39.37,71.91 v39.85,71.91
  Bottom 0.508: v60.01,58.74 55.09,58.74 44.13,69.69 44.13,71.28 43.5,71.91 v39.85,71.91
C1  (via drill 0.41)
  Top 0.203: U$2.3 91.44,68.74 92.55,67.63 92.55,41.59 v79.69,28.73
  Bottom 0.203: v79.69,28.73 54.61,28.73 53.82,27.94 45.72,27.94 U$1.5
C2
  Bottom 0.203: U$5.3 91.44,63.66 98.9,56.2 98.9,43.18 92.55,36.83 92.55,36.51 83.82,27.78 63.02,27.78 60.64,25.4 43.18,25.4 U$1.6
C3  (via drill 0.41)
  Top 0.203: U$7.3 91.44,50.64 v79.69,38.89
  Bottom 0.203: v79.69,38.89 75.88,38.89 70.17,33.18 42.86,33.18 40.8,35.24 40.48,35.24 39.37,34.13 U$1.7
C4  (via drill 0.41)
  Top 0.203: U$1.8 v44.13,33.97
  Bottom 0.203: U$10.3 87.79,46.99 81.44,40.64 76.99,40.64 70.33,33.97 v44.13,33.97
C5  (via drill 0.41)
  Top 0.203: v51.28,31.27 47.94,31.27 44.45,34.77 43.5,34.77 36.67,27.94 35.56,27.94 U$1.9
  Bottom 0.203: U$12.3 88.42,36.83 82.87,31.27 v51.28,31.27
C6  (via drill 0.41)
  Top 0.203: v43.02,21.59 36.83,21.59 v35.08,23.34
  Bottom 0.203: U$14.3 87.79,26.67 82.71,21.59 v43.02,21.59 | U$1.10 v35.08,23.34
C7
  Bottom 0.203: U$16.3 87.79,16.51 85.25,13.97 31.91,13.97 30.48,15.4 30.16,15.4 25.24,20.32 25.24,21.11 25.88,21.75 28.89,21.75 30.16,20.48 30.8,20.48 32.86,22.54 32.86,23.02 U$1.11
C8
  Bottom 0.203: U$18.3 87.79,6.35 84.61,3.17 71.6,3.17 70.96,3.81 60.17,3.81 57.63,1.27 36.99,1.27 30.48,7.78 25.08,7.78 10.16,22.7 10.16,23.02 12.06,24.92 24.92,24.92 U$1.12
C9  (via drill 0.41)
  Top 0.203: U$20.3 15.72,73.66 23.18,66.2 36.04,66.2 38.73,63.5 40.32,63.5 v40.48,63.66 | v40.48,54.61 40.48,52.7 35.56,47.78 35.56,41.43 36.35,40.64 37.31,40.64 38.1,41.43 38.1,42.39 38.89,43.18 39.85,43.18 40.64,42.39 40.64,37.31 v38.89,35.56 | v31.75,34.29 25.4,27.94 22.86,27.94 U$1.24
  Bottom 0.203: v40.48,54.61 v40.48,63.66 | v38.89,35.56 33.02,35.56 v31.75,34.29
C10  (via drill 0.41)
  Top 0.203: U$22.3 11.43,54.77 13.49,52.7 13.49,51.75 v17.78,47.47 | v31.59,43.5 v33.97,45.88
  Bottom 0.203: v17.78,47.47 27.94,47.47 31.91,51.44 33.34,51.44 33.97,50.8 v33.97,45.88 | v31.59,43.5 30.48,42.39 30.48,33.02 25.4,27.94 20.32,27.94 U$1.25
C11  (via drill 0.41)
  Top 0.203: U$24.3 22.86,58.58 v24.61,56.83 | v24.61,51.44 v24.61,53.98 | v12.7,43.5 12.7,41.43 13.49,40.64 14.45,40.64 15.56,39.53 15.56,27.62 U$1.26
  Bottom 0.203: v24.61,53.98 v24.61,56.83 | v24.61,51.44 24.13,51.44 20.95,48.26 17.46,48.26 v12.7,43.5
C12  (via drill 0.41)
  Top 0.203: v45.72,45.56 U$26.3
  Bottom 0.203: v45.72,45.56 42.86,45.56 37.31,51.12 36.99,51.12 35.4,49.53 35.4,44.77 33.02,42.39 33.02,41.43 30.96,39.37 30.96,32.7 25.4,27.15 25.4,26.19 24.61,25.4 15.24,25.4 U$1.27
CAN_HIGH
  Top 0.203: CAN.1 ISO1050.7
CAN_LOW
  Top 0.203: CAN.2 ISO1050.6
CHARGE+  (via drill 0.41)
  Top 1.016: U$20.2 10.16,71.91 20.32,61.75 U$24.2 | U$18.2 U$16.2 U$14.2 U$12.2 U$10.2 U$7.2 U$5.2 U$2.2 | v43.18,47.47 U$26.2 | v61.28,38.89 61.28,28.89 67.31,22.86 U$8.3
  Bottom 1.016: U$22.2 12.7,53.34 19.21,59.85 | U$24.2 19.21,59.85 | U$26.2 42.7,50.8 33.97,59.53 19.53,59.53 19.21,59.85 | U$8.3 71.12,2.54 71.28,2.38 90.01,2.38 U$18.2 | v43.18,47.47 56.36,47.47 61.28,42.55 v61.28,38.89
CHARGE-
  Top 1.016: U$20.1 7.62,54.61 U$22.1 | U$18.1 U$16.1 U$14.1 U$12.1 U$10.1 U$7.1 U$5.1 U$2.1
  Bottom 1.016: U$24.1 14.45,60.96 10,56.52 10,52.7 11.43,51.28 U$22.1 11.91,50.8 19.05,57.94 33.66,57.94 34.29,57.31 34.29,57.15 U$26.1 41.12,50.64 43.02,48.74 94.77,48.74 U$10.1 | U$8.5 54.93,2.54 60.17,7.78 95.09,7.78 U$18.1
FAULT  (via drill 0.41)
  Top 0.203: v10.95,22.86 R1.2 | v32.07,22.86 33.66,22.86 35.24,24.45 49.85,24.45 U$1.2
  Bottom 0.203: v32.07,22.86 v10.95,22.86
GLV_5V
  Top 0.203: ISO1540.1 37.47,11.43 20.95,11.43 ISO1050.8 15.56,16.83 7.14,16.83 6.35,16.03 IC1.1
GLV_12V
  Top 1.016: IC1.3 8.89,6.83 9.37,6.35 J1.1 | U$8.1 59.69,22.54 42.07,4.92 42.07,2.38 41.27,1.59 32.7,1.59 U$3.1
  Bottom 1.016: U$3.1 20.64,3.81 18.1,6.35 J1.1
GLV_GND
  Top 1.016: ISO1050.5 8.89,15.88 IC1.2 | J1.3 3.49,6.35 6.35,3.49 J1.2 6.83,1.59 25.4,1.59 30,6.19 U$3.2 37.94,6.35 41.27,9.68 41.27,10 | 41.27,10 ISO1540.4 | U$8.2 41.75,10 41.27,10
  Bottom 1.016: IC1.2 6.35,15.88 3.49,13.02 3.49,6.35 J1.3
GND
  Top 1.016: ON_LED.C 2.54,17.46 4.29,19.21 4.29,19.84 5.4,20.95 12.06,20.95 | 12.06,20.95 ISO1050.4 14.92,18.73 30.16,18.73 U$3.6 40.01,19.05 41.27,17.78 | 12.06,20.95 12.06,23.34 11.27,24.13 4.76,24.13 3.65,23.02 FAULT_LED.C | 41.27,17.78 ISO1540.5 | U$1.GND 59.37,26.67 57.15,24.45 50.96,24.45 44.45,17.94 41.75,17.94 41.27,17.78
N$1
  Top 0.508: R14.1 71.6,71.12 71.6,71.6 73.98,73.98 73.98,74.93 U$4.6 74.14,75.09 74.14,77.47 R27.1 | C1.1 71.12,78.26 73.34,78.26 73.98,77.63 R27.1 | U$2.5 82.87,77.47 81.6,78.74 75.41,78.74 74.3,77.63 R27.1
N$3
  Top 0.203: ISO1050.3 15.88,20.95 17.3,19.53 26.99,19.53 32.38,24.92 47.78,24.92 U$1.3
N$4
  Top 0.203: ISO1050.2 18.41,20.95 22.86,25.4 45.72,25.4 U$1.4
N$5
  Top 0.508: R3.1 71.6,60.96 71.6,61.44 73.98,63.82 73.98,64.77 U$6.6 | U$6.6 74.14,64.93 74.14,67.31 R28.1 74.3,67.47 75.41,68.58 81.6,68.58 82.87,67.31 U$5.5 | C3.1 71.12,68.1 73.98,65.25 U$6.6
N$6
  Top 0.203: R2.1 5.4,19.05 5.4,15.56 2.54,12.7 ON_LED.A
N$7
  Top 0.203: R1.1 5.08,22.86 2.54,20.32 FAULT_LED.A
N$8
  Top 0.203: R27.2 75.88,77.47 75.88,75.09 U$4.4
N$9
  Top 0.203: R28.2 75.88,67.31 75.88,64.93 U$6.4
N$10
  Top 0.508: R4.1 71.44,49.53 71.44,50.16 71.12,50.48 C5.1 71.28,51.28 73.98,53.98 74.14,53.98 | 74.14,53.98 74.14,53.5 U$9.6 | 74.14,53.98 74.14,57.15 R29.1 74.3,57.31 75.41,58.42 81.6,58.42 82.87,57.15 U$7.5
N$11  (via drill 0.41)
  Top 0.203: v75.88,56.04 75.88,57.15 R29.2 | v77.15,54.77 75.88,53.5 U$9.4
  Bottom 0.203: v77.15,54.77 v75.88,56.04
N$12
  Top 0.508: R5.1 71.44,39.37 71.44,40.64 71.12,40.96 C7.1 71.6,40.8 73.82,43.02 U$11.6 74.14,43.34 74.14,45.72 R30.1 74.3,45.88 75.25,46.83 76.36,46.83 77.47,45.72 81.6,45.72 82.87,46.99 U$10.5
N$13
  Top 0.203: R30.2 75.88,45.72 75.88,43.34 U$11.4
N$14
  Top 0.508: R6.1 71.44,29.21 71.44,30.48 71.12,30.8 C9.1 71.6,30.64 73.82,32.86 U$13.6 74.14,33.18 74.14,35.56 R31.1 74.3,35.72 75.25,36.67 76.36,36.67 77.47,35.56 81.6,35.56 82.87,36.83 U$12.5
N$15
  Top 0.203: R31.2 75.88,35.56 75.88,33.18 U$13.4
N$16
  Top 0.508: R7.1 71.44,19.05 71.44,20.32 71.12,20.64 C11.1 71.6,20.48 73.82,22.7 U$15.6 74.14,23.02 74.14,25.4 R32.1 74.3,25.56 75.25,26.51 76.36,26.51 77.47,25.4 81.6,25.4 82.87,26.67 U$14.5
N$17
  Top 0.203: R32.2 75.88,25.4 75.88,23.02 U$15.4
N$18
  Top 0.508: R8.1 71.44,10.16 71.44,11.43 71.12,11.75 C13.1 71.6,11.59 73.82,13.81 U$17.6 74.14,14.13 74.14,16.51 R33.1 74.3,16.67 75.41,17.78 81.6,17.78 82.87,16.51 U$16.5
N$19
  Top 0.203: R33.2 75.88,16.51 75.88,14.13 U$17.4
N$20  (via drill 0.41)
  Top 0.508: R34.1 74.14,7.62 v74.14,6.35 74.14,5.24 U$19.6 | R9.1 71.44,1.27 71.44,2.54 71.12,2.86 C15.1 71.28,3.02 v72.39,4.13
  Bottom 0.508: 74.14,4.13 81.6,4.13 U$18.5 | 74.14,4.13 v72.39,4.13 | 74.14,4.13 v74.14,6.35
N$21
  Top 0.203: R34.2 75.88,7.62 75.88,5.24 U$19.4
N$22
  Top 0.508: 28.42,72.07 28.42,71.12 R13.1 | 29.37,73.03 30,73.66 R35.1 30.16,73.82 30.16,76.04 U$21.6 | 29.37,73.03 28.42,72.07 | C17.1 33.02,72.87 29.53,72.87 29.37,73.03 | U$20.5 21.27,73.66 22.7,72.23 28.26,72.23 28.42,72.07
N$23
  Top 0.203: R35.2 28.42,73.66 28.42,76.04 U$21.4
N$24
  Top 0.508: R36.1 18.73,50.8 18.73,53.18 U$23.6 | 19.37,49.69 19.37,50.16 18.89,50.64 R36.1 | 19.37,49.69 19.37,48.26 R12.1 | C19.1 21.59,51.28 18.89,51.28 R36.1 | U$22.5 11.43,62.55 14.13,59.85 14.13,51.91 16.35,49.69 19.37,49.69
N$25
  Top 0.203: R36.2 16.99,50.8 16.99,53.18 U$23.4
N$26  (via drill 0.41)
  Top 0.508: R11.1 27.15,48.26 27.15,50.48 27.46,50.8 R37.1 | R37.1 27.62,50.96 27.78,51.12 30.48,51.12 C21.1 30.64,51.28 36.35,56.99 v36.35,58.74 | U$25.6 27.62,53.18 27.62,51.28 R37.1
  Bottom 0.508: U$24.5 31.43,60.96 32.7,62.23 33.34,62.23 34.29,61.28 34.29,60.64 36.2,58.74 v36.35,58.74
N$27
  Top 0.203: R37.2 25.88,50.8 25.88,53.18 U$25.4
N$28
  Top 0.508: C23.1 66.04,53.02 63.34,53.02 63.18,53.18 U$27.6 63.18,52.86 63.18,50.96 R38.1 63.02,50.8 61.44,49.21 | 61.44,49.21 61.44,48.26 R10.1 | U$26.5 54.29,50.8 55.72,49.37 61.28,49.37 61.44,49.21
N$29
  Top 0.203: R38.2 61.44,50.8 61.44,53.18 U$27.4
N$30
  Top 0.203: R3.2 73.34,60.96 73.34,61.44 73.98,62.07 U$6.1
N$31
  Top 0.203: R13.2 32.86,71.12 33.81,72.07 33.81,73.5 33.66,73.66 32.38,73.66 30.8,75.25 30.8,78.11 30.16,78.74 U$21.1
N$32
  Top 0.203: R12.2 21.27,48.26 21.27,49.37 22.38,50.48 22.38,55.72 22.23,55.88 18.73,55.88 U$23.1
N$33  (via drill 0.41)
  Top 0.203: v28.73,50.16 28.73,48.26 R11.2 | v28.73,55.4 28.1,55.4 27.62,55.88 U$25.1
  Bottom 0.203: v28.73,55.4 v28.73,50.16
N$34  (via drill 0.41)
  Top 0.203: v64.29,50.48 63.18,49.37 63.18,48.26 R10.2 | v64.29,55.4 63.66,55.4 63.18,55.88 U$27.1
  Bottom 0.203: v64.29,55.4 v64.29,50.48
N$35
  Top 0.203: R9.2 73.34,1.27 73.34,1.75 73.98,2.38 U$19.1
N$36
  Top 0.203: R8.2 73.34,10.16 73.34,10.64 73.98,11.27 U$17.1
N$37
  Top 0.203: R7.2 73.34,19.05 73.34,19.53 73.98,20.16 U$15.1
N$38
  Top 0.203: R6.2 73.34,29.21 73.34,29.69 73.98,30.32 U$13.1
N$39
  Top 0.203: R5.2 73.34,39.37 73.34,39.85 73.98,40.48 U$11.1
N$40
  Top 0.203: R4.2 73.34,49.53 73.34,50.01 73.98,50.64 U$9.1
N$41
  Top 0.203: R14.2 73.34,71.12 73.34,71.6 73.98,72.23 U$4.1
SCL  (via drill 0.41)
  Top 0.203: U$1.19 41.12,41.12 41.12,35.56 R15.2 40.96,35.56 40.64,35.24 v40.64,34.45 | ISO1540.6 40.01,16.03 40.96,15.08 41.59,15.08 v42.23,15.72
  Bottom 0.203: v42.23,15.72 42.23,24.61 40.64,26.19 v40.64,34.45
SCL_GLV  (via drill 0.41)
  Top 0.203: ISO1540.3 40.01,10 v39.69,9.68
  Bottom 0.203: v39.69,9.68 39.69,4.76 I2C.1
SDA  (via drill 0.41)
  Top 0.203: 37.78,35.56 37.78,40.32 U$1.18 | ISO1540.7 38.73,17.14 37.94,17.94 v36.51,17.94 | v38.1,34.45 38.1,35.24 37.78,35.56 | 37.78,35.56 R16.2
  Bottom 0.203: v36.51,17.94 36.51,24.61 38.1,26.19 v38.1,34.45
SDA_GLV  (via drill 0.41)
  Top 0.203: v38.73,8.73 ISO1540.2
  Bottom 0.203: v38.73,8.73 38.73,4.45 I2C.2
TS1
  Top 0.203: TEMP_SENSE.12 2.22,50.8 4.45,48.58 4.45,45.09 U$1.33
TS2
  Top 0.203: TEMP_SENSE.11 1.91,53.02 4.92,50.01 4.92,43.02 U$1.34
TS3  (via drill 0.41)
  Top 0.203: TEMP_SENSE.10 3.17,55.88 v11.27,47.78
  Bottom 0.203: v11.27,47.78 11.27,46.83 U$1.35
TS4  (via drill 0.41)
  Top 0.203: v12.38,47.94 TEMP_SENSE.9
  Bottom 0.203: v12.38,47.94 12.38,47.31 8.89,43.81 U$1.36
TS5  (via drill 0.41)
  Top 0.203: v7.14,49.05 7.14,47.31 11.43,43.02 U$1.37
  Bottom 0.203: TEMP_SENSE.8 1.91,60.64 4.92,57.63 4.92,51.28 v7.14,49.05
TS6  (via drill 0.41)
  Top 0.203: v8.26,49.05 8.26,48.26 v11.27,45.24 | v17.46,45.56 v15.56,47.47
  Bottom 0.203: TEMP_SENSE.7 5.87,63.5 8.26,61.12 v8.26,49.05 | v11.27,45.24 13.34,45.24 v15.56,47.47 | v17.46,45.56 17.46,45.24 17.62,45.09 17.62,44.45 16.35,43.18 15.24,43.18 U$1.38
TS7  (via drill 0.41)
  Top 0.203: v10.32,59.69 10.32,53.02 11.43,51.91 11.75,51.91 13.34,50.32 13.34,48.74 v16.19,45.88 | v15.24,43.97 15.24,43.18 U$1.39
  Bottom 0.203: TEMP_SENSE.6 3.97,66.04 v10.32,59.69 | v16.19,45.88 17.14,44.93 17.14,44.61 16.51,43.97 v15.24,43.97
TS8  (via drill 0.41)
  Top 0.203: TEMP_SENSE.5 1.91,68.9 6.51,73.5 6.51,73.98 7.3,74.77 7.94,74.77 9.05,73.66 9.05,66.99 11.43,64.61 11.75,64.61 15.08,61.28 v15.08,52.23 | v18.57,45.72 v14.13,50.16 | v17.62,43.18 18.89,41.91 U$1.A21
  Bottom 0.203: v15.08,52.23 15.08,51.12 v14.13,50.16 | v18.57,45.72 18.57,44.13 v17.62,43.18
TS9  (via drill 0.41)
  Top 0.203: v4.13,57.15 v4.13,68.9 | v4.13,53.98 4.45,53.98 10.48,47.94 10.48,47.62 13.34,44.77 15.4,44.77 16.19,43.97 26.67,43.97 v27.94,42.7
  Bottom 0.203: v4.13,68.9 TEMP_SENSE.4 | v4.13,53.98 v4.13,57.15 | v27.94,42.7 27.94,41.43 27.15,40.64 22.86,40.64 U$1.A22
TS10  (via drill 0.41)
  Top 0.203: TEMP_SENSE.3 5.56,73.66 7.14,75.25 22.7,75.25 24.13,73.82 v24.13,73.5 | v65.09,43.81 v65.09,49.85 | v62.39,41.12 50.8,29.53 U$1.DM
  Bottom 0.203: v24.13,73.5 25.08,72.55 39.53,72.55 39.69,72.71 52.7,72.71 63.02,62.39 63.02,57.63 65.09,55.56 v65.09,49.85 | v62.39,41.12 v65.09,43.81
TS11  (via drill 0.41)
  Top 0.203: TEMP_SENSE.2 25.08,76.2 v27.15,74.14
  Bottom 0.203: v27.15,74.14 63.66,74.14 64.93,75.41 64.93,77.31 65.72,78.11 66.36,78.11 86.2,58.26 86.68,58.26 97.63,47.31 97.63,46.67 83.03,32.07 51.12,32.07 U$1.DP
TS12  (via drill 0.41)
  Top 0.203: 49.TP 6.35,50.8 v5.71,51.44 | v5.71,71.75 v5.71,62.71
  Bottom 0.203: v5.71,62.71 v5.71,51.44 | v5.71,71.75 5.71,74.93 TEMP_SENSE.1
VS1  (via drill 0.41)
  Top 0.203: v68.42,64.29 67.31,64.29 RBL1.2 | v68.42,67.79 67.31,68.9 RBH1.1 | v72.23,50.64 72.23,50.32 72.39,50.16 v72.39,47.15 | U$1.14 v34.77,36.35
  Bottom 0.203: v68.42,67.79 v68.42,64.29 68.42,54.45 v72.23,50.64 | v72.39,47.15 72.39,46.04 62.71,36.35 v34.77,36.35
VS2  (via drill 0.41)
  Top 0.203: RBH2.1 64.77,65.56 | 64.77,65.56 RBL2.2 | v66.99,65.56 64.77,65.56 | v67.15,41.75 v67.15,50.32 | U$1.15 v36.51,37.15
  Bottom 0.203: v66.99,65.56 66.99,50.48 v67.15,50.32 | v67.15,41.75 66.83,41.75 62.23,37.15 v36.51,37.15
VS3  (via drill 0.41)
  Top 0.203: RBH3.1 RBL3.2 62.23,64.29 63.34,64.29 64.14,63.5 65.72,63.5 65.88,63.66 66.52,63.66 66.67,63.5 67.94,63.5 68.26,63.18 68.26,62.07 67.94,61.75 64.93,61.75 64.29,61.12 64.29,60.64 68.42,56.52 68.42,45.4 v68.74,45.09
  Bottom 0.203: v68.74,45.09 68.74,44.29 62.07,37.62 38.58,37.62 U$1.16
VS4  (via drill 0.41)
  Top 0.203: RBH4.1 59.69,64.77 | 59.69,64.77 RBL4.2 59.69,64.45 | v58.58,64.77 59.69,64.77 | v57.63,59.69 57.63,58.42 v55.4,56.2 | v48.74,56.2 44.61,56.2 36.83,48.42 U$1.17
  Bottom 0.203: v58.58,64.77 57.63,63.82 v57.63,59.69 | v48.74,56.2 v55.4,56.2
VS5  (via drill 0.41)
  Top 0.203: RBH5.1 RBL5.2 57.15,64.29 57.78,64.29 v58.42,63.66 | v48.74,52.86 46.83,52.86 46.04,53.66 44.61,53.66 42.07,51.12 42.07,44.29 U$1.20
  Bottom 0.203: v58.42,63.66 58.42,61.28 60.8,58.9 60.8,54.61 56.99,50.8 56.99,50.48 56.2,49.69 49.37,49.69 48.74,50.32 v48.74,52.86
VS6  (via drill 0.41)
  Top 0.203: RBH6.1 54.61,68.9 55.24,68.26 55.24,67.31 54.61,66.67 RBL6.2 54.61,64.29 v55.72,64.29 | v55.72,61.75 62.55,61.75 67.94,56.36 v67.94,44.45
  Bottom 0.203: v55.72,61.75 v55.72,64.29 | v67.94,44.45 61.59,38.1 49.05,38.1 48.26,38.89 48.26,40.01 46.99,41.27 U$1.21
VS7  (via drill 0.41)
  Top 0.203: RBH7.1 RBL7.2 52.07,64.29 50.96,64.29 50.16,63.5 46.04,63.5 v45.88,63.66 | v45.88,52.86 49.53,49.21 U$1.22
  Bottom 0.203: v45.88,52.86 v45.88,63.66
VS8  (via drill 0.41)
  Top 0.203: RBL8.2 RBH8.1 49.53,69.06 48.42,69.06 47.62,69.85 46.35,69.85 45.72,69.22 v45.72,65.88 | v47.94,49.85 47.94,42.7 48.26,42.39 48.26,41.43 49.05,40.64 50.8,40.64 U$1.23
  Bottom 0.203: v45.72,65.88 47.94,63.66 v47.94,49.85
VS9  (via drill 0.41)
  Top 0.203: RBH9.1 46.99,64.77 | 46.99,64.77 RBL9.2 46.99,64.45 | v45.88,64.77 46.99,64.77 | v46.83,43.81 v46.83,49.85
  Bottom 0.203: v45.88,64.77 46.83,63.82 v46.83,49.85 | v46.83,43.81 48.26,42.39 48.26,40.64 U$1.A10
VS10  (via drill 0.41)
  Top 0.203: RBH10.1 v44.45,65.56 RBL10.2 | v44.45,49.85 44.45,43.66 45.72,42.39 45.72,40.64 U$1.A11
  Bottom 0.203: v44.45,49.85 v44.45,65.56
VS11  (via drill 0.41)
  Top 0.203: RBH11.1 v41.91,65.56 RBL11.2 | v41.91,59.53 27.15,44.77 v16.35,44.77 | v12.7,38.26 12.7,30.48 10.16,27.94 5.08,27.94 U$1.31
  Bottom 0.203: v41.91,59.53 v41.91,65.56 | v16.35,44.77 15.08,44.77 12.7,42.39 v12.7,38.26
VS12  (via drill 0.41)
  Top 0.203: RBH12.1 39.37,64.93 | 39.37,64.93 RBL12.2 | v38.26,64.93 39.37,64.93 | v30,48.58 v38.26,56.83
  Bottom 0.203: v38.26,56.83 v38.26,64.93 | v30,48.58 29.69,48.58 24.29,43.18 18.57,43.18 17.78,42.39 17.78,41.43 14.45,38.1 13.49,38.1 12.38,36.99 12.38,30.16 10.16,27.94 2.54,27.94 U$1.32

### Text on the board
tPlace: HI / LOW | SDA / SCL